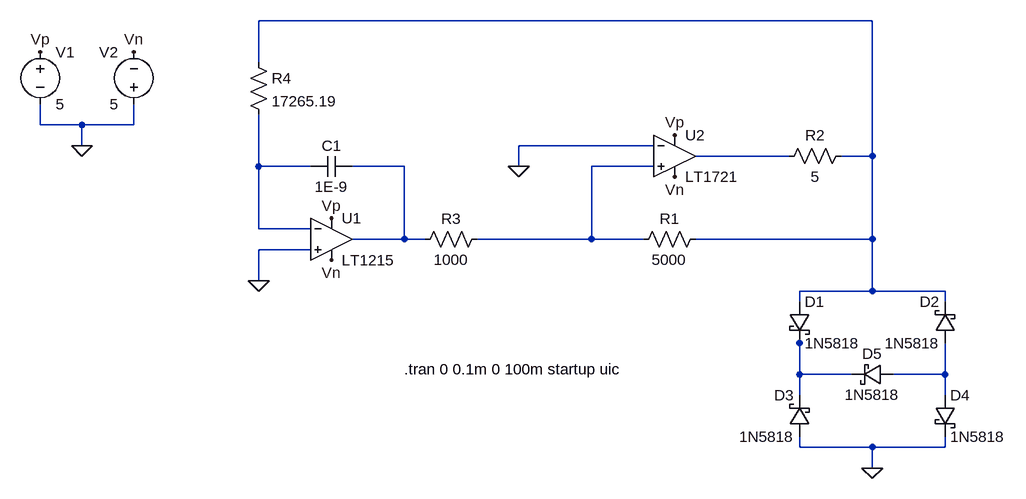
[diagram p0: schematic Draft2.asc]
Draft2.asc, the LTspice schematic file:
Version 4
SHEET 1 1040 680
WIRE 608 -224 -336 -224
WIRE -336 -160 -336 -224
WIRE -672 -64 -672 -96
WIRE -608 -64 -672 -64
WIRE -528 -64 -528 -96
WIRE -528 -64 -608 -64
WIRE -608 -32 -608 -64
WIRE 272 -32 64 -32
WIRE 480 -16 336 -16
WIRE 608 -16 608 -224
WIRE 608 -16 560 -16
WIRE -336 0 -336 -80
WIRE -256 0 -336 0
WIRE -112 0 -192 0
WIRE 64 0 64 -32
WIRE 272 0 176 0
WIRE -336 96 -336 0
WIRE -256 96 -336 96
WIRE -112 112 -112 0
WIRE -112 112 -192 112
WIRE -80 112 -112 112
WIRE 176 112 176 0
WIRE 176 112 0 112
WIRE 256 112 176 112
WIRE 608 112 608 -16
WIRE 608 112 336 112
WIRE -256 128 -336 128
WIRE -336 176 -336 128
WIRE 608 192 608 112
WIRE 608 192 496 192
WIRE 720 192 608 192
WIRE 496 208 496 192
WIRE 720 208 720 192
WIRE 496 272 496 256
WIRE 496 320 496 272
WIRE 576 320 496 320
WIRE 720 320 720 272
WIRE 720 320 640 320
WIRE 496 352 496 320
WIRE 720 352 720 320
WIRE 496 432 496 416
WIRE 608 432 496 432
WIRE 720 432 720 416
WIRE 720 432 608 432
WIRE 608 464 608 432
FLAG 64 0 0
FLAG -336 176 0
FLAG -224 80 Vp
FLAG 304 -48 Vp
FLAG -224 144 Vn
FLAG 304 16 Vn
FLAG 608 464 0
FLAG -608 -32 0
FLAG -672 -176 Vp
FLAG -528 -176 Vn
SYMBOL res 352 96 R90
WINDOW 0 0 56 VBottom 2
WINDOW 3 32 56 VTop 2
SYMATTR InstName R1
SYMATTR Value 5000
SYMBOL res 576 -32 R90
WINDOW 0 0 56 VBottom 2
WINDOW 3 32 56 VTop 2
SYMATTR InstName R2
SYMATTR Value 5
SYMBOL res 16 96 R90
WINDOW 0 0 56 VBottom 2
WINDOW 3 32 56 VTop 2
SYMATTR InstName R3
SYMATTR Value 1000
SYMBOL Opamps\\LT1215 -224 48 R0
SYMATTR InstName U1
SYMBOL cap -192 -16 R90
WINDOW 0 0 32 VBottom 2
WINDOW 3 32 32 VTop 2
SYMATTR InstName C1
SYMATTR Value 1E-9
SYMBOL res -352 -176 R0
SYMATTR InstName R4
SYMATTR Value 17265.19
SYMBOL schottky 480 208 R0
SYMATTR InstName D1
SYMATTR Value 1N5818
SYMATTR Description Diode
SYMATTR Type diode
SYMBOL schottky 736 272 R180
WINDOW 0 24 64 Left 2
WINDOW 3 24 0 Left 2
SYMATTR InstName D2
SYMATTR Value 1N5818
SYMATTR Description Diode
SYMATTR Type diode
SYMBOL schottky 512 416 R180
WINDOW 0 24 64 Left 2
WINDOW 3 24 0 Left 2
SYMATTR InstName D3
SYMATTR Value 1N5818
SYMATTR Description Diode
SYMATTR Type diode
SYMBOL schottky 704 352 R0
SYMATTR InstName D4
SYMATTR Value 1N5818
SYMATTR Description Diode
SYMATTR Type diode
SYMBOL schottky 640 304 R90
WINDOW 0 0 32 VBottom 2
WINDOW 3 32 32 VTop 2
SYMATTR InstName D5
SYMATTR Value 1N5818
SYMATTR Description Diode
SYMATTR Type diode
SYMBOL Comparators\\LT1721 304 -80 R0
SYMATTR InstName U2
SYMBOL voltage -672 -192 R0
SYMATTR InstName V1
SYMATTR Value 5
SYMBOL voltage -528 -80 R180
WINDOW 0 24 96 Left 2
WINDOW 3 24 16 Left 2
SYMATTR InstName V2
SYMATTR Value 5
TEXT -112 312 Left 2 !.tran 0 0.1m 0 100m startup uic

The netlist it stands for:
* Draft2.asc
R1 N001 N005 5000
R2 N001 N002 5
R3 N005 N004 1000
XU1 0 N003 Vp Vn N004 LT1215  ; pins In+ In- V+ V- OUT
C1 N004 N003 1E-9
R4 N001 N003 17265.19
D1 N001 N006 1N5818
D2 N007 N001 1N5818
D3 0 N006 1N5818
D4 N007 0 1N5818
D5 N007 N006 1N5818
XU2 N005 0 Vp Vn N002 LT1720  ; LT1721, pins In+ In- V+ V- OUT
V1 Vp 0 5
V2 0 Vn 5
.model D D
.lib standard.dio
.tran 0 0.1m 0 100m startup uic
.lib LTC.lib
.backanno
.end

* Results of the author's LTspice run, read from the files saved beside the schematic
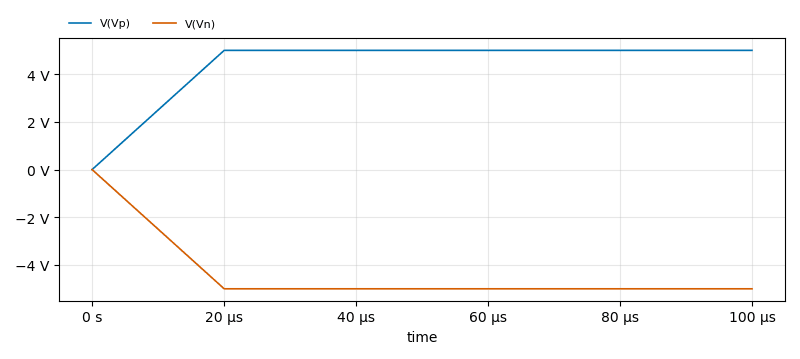
[diagram p1: Transient Analysis of Draft2.asc, plotted from the saved traces]
* Transient Analysis, 1 run:
*   V(Vp): min 0 V, max 5 V, average 4.5 V, rms 4.655 V, last 5 V
*   V(Vn): min -5 V, max 0 V, average -4.5 V, rms 4.655 V, last -5 V